# Altium project RMS_to_DC.PrjPcb
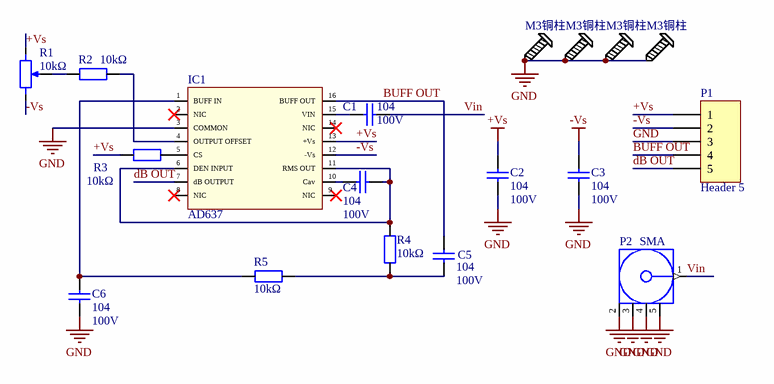
[diagram p0: RMS_to_DC.SchDoc]
2 sheets, 47 parts. Net scope: global (net labels, ports and power ports of the same name join across sheets).
Board files: RMS_to_DC_1.PCBDOC, RMS_to_DC.PcbDoc
Sheets:
  RMS_to_DC.SchDoc
  RMS_to_DC_1.SchDoc

## Sheet RMS_to_DC.SchDoc
size A4; DrawnBy: 阳光电路; Organization: 阳光电路; Address1: 中国; Address2: 桂林; Address3: 阳朔; Address4: 中国 2021

### Parts
C1  voltage: 100V  [C0603]  (hidden comment: 叠层陶瓷电容)
C2  voltage: 100V  [C0603]  (hidden comment: 叠层陶瓷电容)
C3  voltage: 100V  [C0603]  (hidden comment: 叠层陶瓷电容)
C4  voltage: 100V  [C0603]  (hidden comment: 叠层陶瓷电容)
C5  voltage: 100V  [C0603]  (hidden comment: 叠层陶瓷电容)
C6  voltage: 100V  [C0603]  (hidden comment: 叠层陶瓷电容)
IC1  AD637  [SOP-16(体宽7.5mm)]
P1  Header 5  [HDR1X5]
P2  SMA  [SMA-夹板]
R1  10kΩ  [3296W-103]
R2  贴片电阻  [R0603]  (value not drawn)
R3  贴片电阻  [R0603]  (value not drawn)
R4  贴片电阻  [R0603]  (value not drawn)
R5  贴片电阻  [R0603]  (value not drawn)
S1  M3铜柱  [M3]
S2  M3铜柱  [M3]
S3  M3铜柱  [M3]
S4  M3铜柱  [M3]

### Nets
+Vs: C2.2 IC1.13(+Vs) P1.1 R1.3 R3.1
-Vs: C3.2 IC1.12(-Vs) P1.2 R1.1
GND: C2.1 C3.1 C6.1 IC1.3(COMMON) P1.3 P2.2 P2.3 P2.4 P2.5 S1.1(GND) S2.1(GND) S3.1(GND) S4.1(GND)
BUFF OUT: C5.2 IC1.16(BUFF_OUT) P1.4
dB OUT: IC1.7(dB_OUTPUT) P1.5
Vin: C1.2 P2.1
NetC1_1: C1.1 IC1.15(VIN)
NetC4_1: C4.1 IC1.10(Cav)
NetC4_2: C4.2 IC1.6(DEN_INPUT) IC1.11(RMS_OUT) R4.2
NetC5_1: C5.1 R4.1 R5.2
NetC6_2: C6.2 IC1.1(BUFF_IN) R5.1
NetIC1_4: IC1.4(OUTPUT_OFFSET) R2.2
NetIC1_5: IC1.5(CS) R3.2
NetR1_2: R1.2 R2.1

Not connected (* = marked no-connect by the designer): IC1 2(NIC)* 8(NIC)* 9(NIC)* 14(NIC)*

### Notes on the sheet
- Title
- DrawnBy:
- Size:
- Date:
- A4
- Number:
- Time:
- Revision:
- Sheet
- of
- File:

### Library data of the parts
C1-C6 = 104: 无极性电容; type: 0805; capacity: 104
IC1 = AD637: RMS TO DC均方根转换芯片
P1 = Header 5: Header, 5-Pin; LatestRevisionDate: 17-Jul-2002; LatestRevisionNote: Re-released for DXP Platform.; Publisher: Altium Limited
P2 = SMA: 射频座
R1 = 100kΩ: 三脚可调式电位器
R2-R5 = 10kΩ: 贴片/直插电阻; package: 0805; resistance: 10kΩ

## Sheet RMS_to_DC_1.SchDoc: RMS_to_DC
size A4; ApprovedBy: 阳光电路; CheckedBy: 阳光电路; Author: 阳光电路; CompanyName: 阳光电路; DrawnBy: 阳光电路; Engineer: 阳光电路; Organization: 阳光电路; Address1: 中国; Address2: 桂林; Address3: 阳朔; Address4: 中国 2021; DocumentNumber: 1; Revision: Rev 1.1.0; SheetNumber: 1; SheetTotal: 1
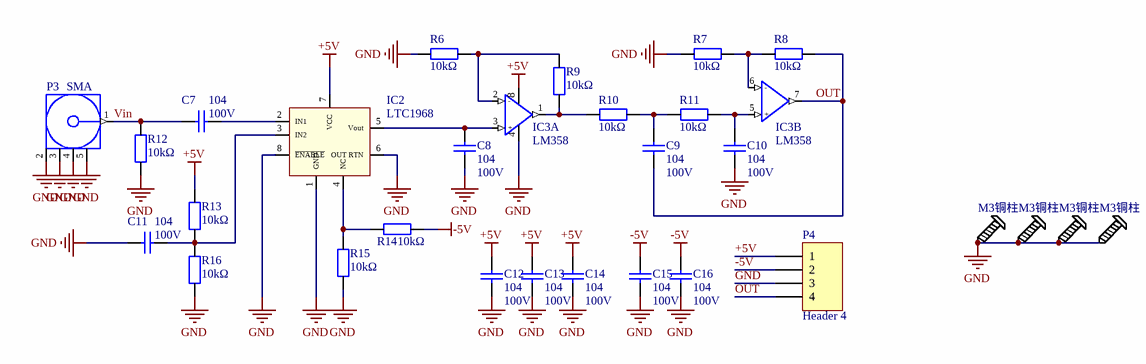
[diagram p1: RMS_to_DC_1.SchDoc]

### Parts
C7  voltage: 100V  [C0603]  (hidden comment: 叠层陶瓷电容)
C8  voltage: 100V  [C0603]  (hidden comment: 叠层陶瓷电容)
C9  voltage: 100V  [C0603]  (hidden comment: 叠层陶瓷电容)
C10  voltage: 100V  [C0603]  (hidden comment: 叠层陶瓷电容)
C11  voltage: 100V  [C0603]  (hidden comment: 叠层陶瓷电容)
C12  voltage: 100V  [C0603]  (hidden comment: 叠层陶瓷电容)
C13  voltage: 100V  [C0603]  (hidden comment: 叠层陶瓷电容)
C14  voltage: 100V  [C0603]  (hidden comment: 叠层陶瓷电容)
C15  voltage: 100V  [C0603]  (hidden comment: 叠层陶瓷电容)
C16  voltage: 100V  [C0603]  (hidden comment: 叠层陶瓷电容)
IC2  LTC1968  [MSOP-8]
IC3  LM358  [SOP-8(体宽3.8mm)]  (parts A,B of 2)
P3  SMA  [SMA-夹板]
P4  Header 4  [HDR1X4]
R6  贴片电阻  [R0603]  (value not drawn)
R7  贴片电阻  [R0603]  (value not drawn)
R8  贴片电阻  [R0603]  (value not drawn)
R9  贴片电阻  [R0603]  (value not drawn)
R10  贴片电阻  [R0603]  (value not drawn)
R11  贴片电阻  [R0603]  (value not drawn)
R12  贴片电阻  [R0603]  (value not drawn)
R13  贴片电阻  [R0603]  (value not drawn)
R14  贴片电阻  [R0603]  (value not drawn)
R15  贴片电阻  [R0603]  (value not drawn)
R16  贴片电阻  [R0603]  (value not drawn)
S5  M3铜柱  [M3]
S6  M3铜柱  [M3]
S7  M3铜柱  [M3]
S8  M3铜柱  [M3]

### Nets
+5V: C12.2 C13.2 C14.2 IC2.7(VCC) IC3.8(vcc) P4.1 R13.2
-5V: C15.2 C16.2 P4.2 R14.1
GND: C8.1 C10.1 C11.1 C12.1 C13.1 C14.1 C15.1 C16.1 IC2.1(GND) IC2.6(OUT_RTN) IC2.8(~{ENABLE}) IC3.4(vee) P3.2 P3.3 P3.4 P3.5 P4.3 R6.1 R7.1 R12.1 R15.1 R16.1 S5.1(GND) S6.1(GND) S7.1(GND) S8.1(GND)
OUT: C9.1 IC3.7(out) P4.4 R8.2
Vin: C7.1 P3.1 R12.2
NetC7_2: C7.2 IC2.2(IN1)
NetC8_2: C8.2 IC2.5(Vout) IC3.3(+)
NetC9_2: C9.2 R10.1 R11.2
NetC10_2: C10.2 IC3.5(+) R11.1
NetC11_2: C11.2 IC2.3(IN2) R13.1 R16.2
NetIC2_4: IC2.4(NC) R14.2 R15.2
NetIC3_1: IC3.1(out) R9.2 R10.2
NetIC3_2: IC3.2(-) R6.2 R9.1
NetIC3_6: IC3.6(-) R7.2 R8.1

### Notes on the sheet
- Title
- DrawnBy:
- Size:
- Date:
- A4
- Number:
- Time:
- Revision:
- Sheet
- of
- File:

### Library data of the parts
C7-C16 = 104: 无极性电容; type: 0805; capacity: 104
IC2 = LTC1968: RMS
IC3 = LM358: 运放; package: SOP-8; type: LM358
P3 = SMA: 射频座
P4 = Header 4: Header, 4-Pin; LatestRevisionDate: 17-Jul-2002; LatestRevisionNote: Re-released for DXP Platform.; Publisher: Altium Limited
R6-R16 = 10kΩ: 贴片/直插电阻; package: 0805; resistance: 10kΩ

## Nets that join several sheets
GND: RMS_to_DC (13 pins), RMS_to_DC_1 (26 pins)
Vin: RMS_to_DC (C1.2 P2.1), RMS_to_DC_1 (C7.1 P3.1 R12.2)